# Altium schematic sheet pca63100_top.SchDoc: Power Profiler Kit II
size A3; Organization: Nordic Semiconductor; Revision: 1.0.1; SheetNumber: 1; SheetTotal: 6; CompanyName: Nordic Semiconductor; DocumentSize: A3
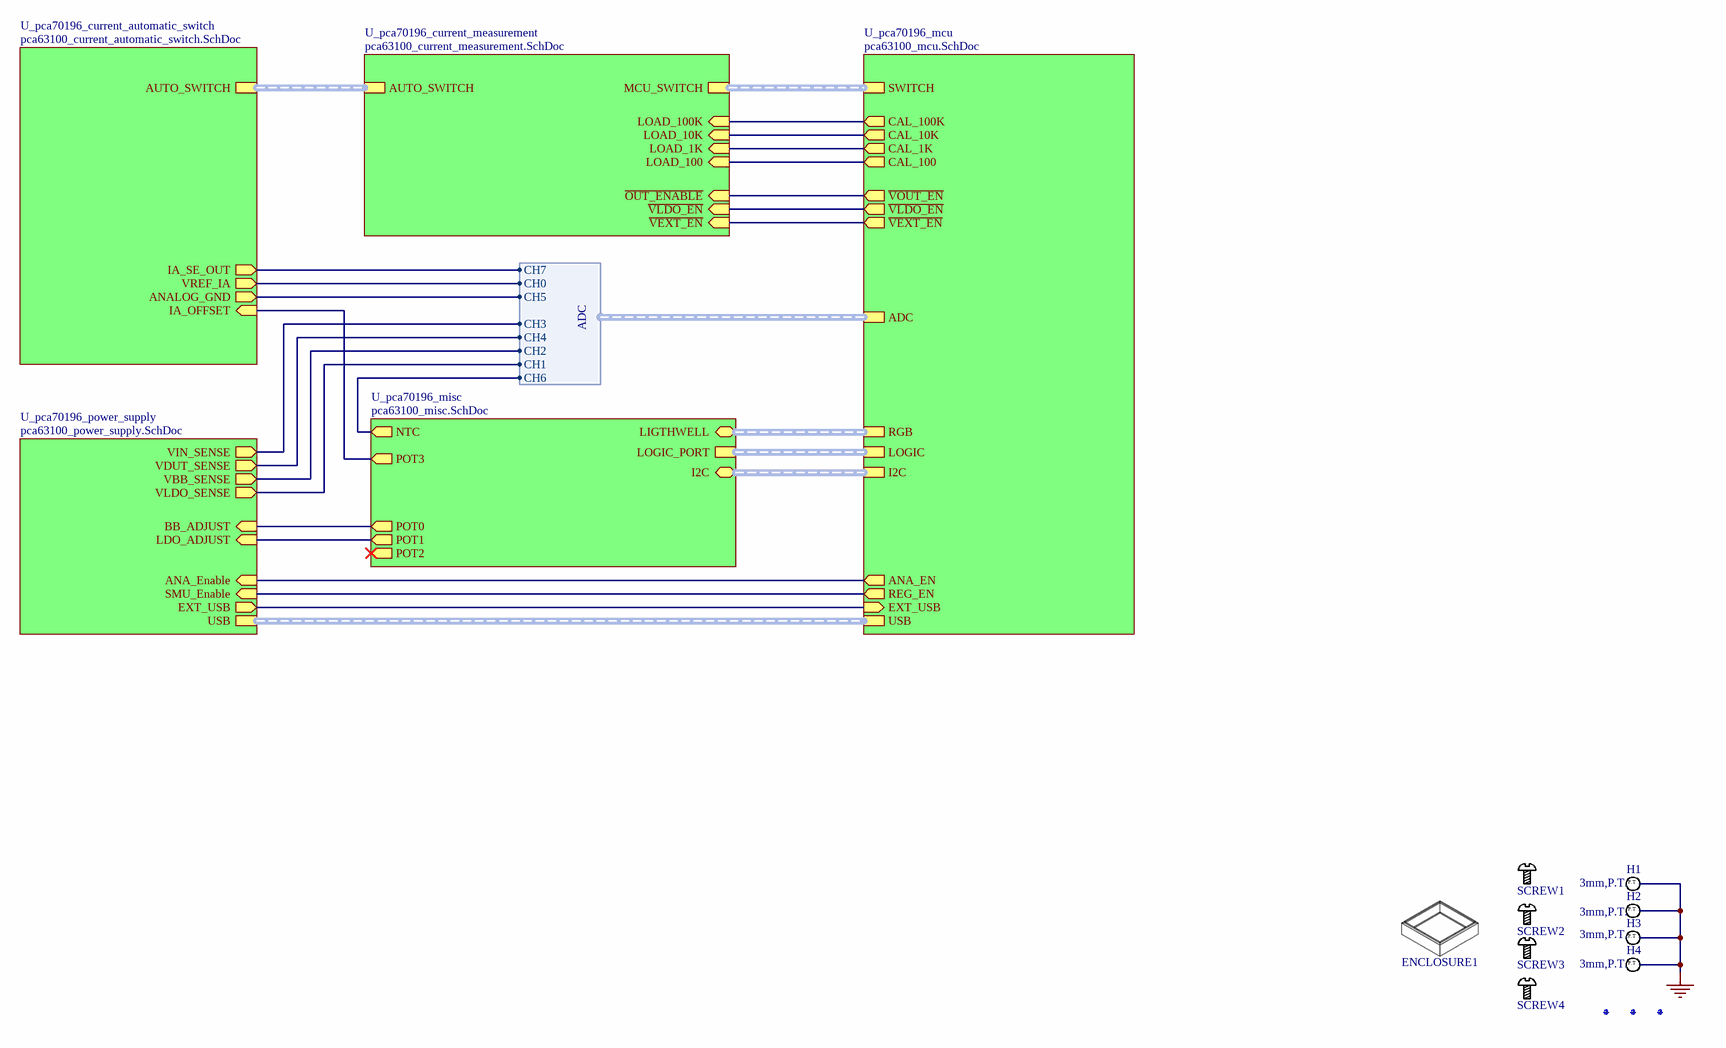
[diagram p0: pca63100_top.SchDoc]

## Parts
ENCLOSURE1  Plastic Enclosure  [Enclosure_PPK2]  (value not drawn)
Fid1  Fiducial mark  [Fiducial_Round-Square]  (value not drawn)  (no BOM)
Fid2  Fiducial mark  [Fiducial_Round-Square]  (value not drawn)  (no BOM)
Fid3  Fiducial mark  [Fiducial_Round-Square]  (value not drawn)  (no BOM)
H1  3mm,P.T.  [HOLE_PT_3MM]  (no BOM)
H2  3mm,P.T.  [HOLE_PT_3MM]  (no BOM)
H3  3mm,P.T.  [HOLE_PT_3MM]  (no BOM)
H4  3mm,P.T.  [HOLE_PT_3MM]  (no BOM)
SCREW1  Screw  [Screw_25x50_pan_tx]  (value not drawn)
SCREW2  Screw  [Screw_25x50_pan_tx]  (value not drawn)
SCREW3  Screw  [Screw_25x50_pan_tx]  (value not drawn)
SCREW4  Screw  [Screw_25x50_pan_tx]  (value not drawn)

## Sub-sheets
U_pca70196_current_automatic_switch = pca63100_current_automatic_switch.SchDoc: IA_SE_OUT (out), IA_OFFSET (in), AUTO_SWITCH (harness SW), VREF_IA (out), ANALOG_GND (out)
U_pca70196_current_measurement = pca63100_current_measurement.SchDoc: ~{OUT_ENABLE} (in), LOAD_100 (in), LOAD_1K (in), LOAD_100K (in), LOAD_10K (in), ~{VEXT_EN} (in), MCU_SWITCH (harness SW), AUTO_SWITCH (harness SW), ~{VLDO_EN} (in)
U_pca70196_mcu = pca63100_mcu.SchDoc: RGB (harness LED), SWITCH (harness SW), I2C (harness I2C), ADC (harness ADC), CAL_10K (out), USB (harness USB), CAL_100K (out), CAL_1K (out), ~{VEXT_EN} (out), CAL_100 (out), ~{VLDO_EN} (out), ~{VOUT_EN} (out), EXT_USB (in), REG_EN (out), ANA_EN (out), LOGIC (harness LP)
U_pca70196_misc = pca63100_misc.SchDoc: POT0 (out), POT1 (out), POT2 (out), POT3 (out), LIGTHWELL (bidir, harness LED), I2C (bidir, harness I2C), NTC (out), LOGIC_PORT (harness LP)
U_pca70196_power_supply = pca63100_power_supply.SchDoc: USB (harness USB), BB_ADJUST (in), LDO_ADJUST (in), VDUT_SENSE (out), VIN_SENSE (out), VLDO_SENSE (out), VBB_SENSE (out), EXT_USB (out), ANA_Enable (in), SMU_Enable (in)

## Harnesses
ADC: CH0, CH1, CH2, CH3, CH4, CH5, CH6, CH7

## Nets
GND: H1.1 H2.1 H3.1 H4.1
(unnamed): sheet U_pca70196_current_automatic_switch/IA_SE_OUT, sheet U_pca70196_mcu/ADC.CH7
(unnamed): sheet U_pca70196_current_automatic_switch/IA_OFFSET, sheet U_pca70196_misc/POT3
(unnamed): sheet U_pca70196_current_automatic_switch/VREF_IA, sheet U_pca70196_mcu/ADC.CH0
(unnamed): sheet U_pca70196_current_automatic_switch/ANALOG_GND, sheet U_pca70196_mcu/ADC.CH5
(unnamed): sheet U_pca70196_current_measurement/~{OUT_ENABLE}, sheet U_pca70196_mcu/~{VOUT_EN}
(unnamed): sheet U_pca70196_current_measurement/LOAD_100, sheet U_pca70196_mcu/CAL_100
(unnamed): sheet U_pca70196_current_measurement/LOAD_1K, sheet U_pca70196_mcu/CAL_1K
(unnamed): sheet U_pca70196_current_measurement/LOAD_100K, sheet U_pca70196_mcu/CAL_100K
(unnamed): sheet U_pca70196_current_measurement/LOAD_10K, sheet U_pca70196_mcu/CAL_10K
(unnamed): sheet U_pca70196_current_measurement/~{VEXT_EN}, sheet U_pca70196_mcu/~{VEXT_EN}
(unnamed): sheet U_pca70196_current_measurement/~{VLDO_EN}, sheet U_pca70196_mcu/~{VLDO_EN}
(unnamed): sheet U_pca70196_power_supply/BB_ADJUST, sheet U_pca70196_misc/POT0
(unnamed): sheet U_pca70196_power_supply/LDO_ADJUST, sheet U_pca70196_misc/POT1
(unnamed): sheet U_pca70196_power_supply/VDUT_SENSE, sheet U_pca70196_mcu/ADC.CH4
(unnamed): sheet U_pca70196_power_supply/VIN_SENSE, sheet U_pca70196_mcu/ADC.CH3
(unnamed): sheet U_pca70196_power_supply/VLDO_SENSE, sheet U_pca70196_mcu/ADC.CH1
(unnamed): sheet U_pca70196_power_supply/VBB_SENSE, sheet U_pca70196_mcu/ADC.CH2
(unnamed): sheet U_pca70196_power_supply/EXT_USB, sheet U_pca70196_mcu/EXT_USB
(unnamed): sheet U_pca70196_power_supply/ANA_Enable, sheet U_pca70196_mcu/ANA_EN
(unnamed): sheet U_pca70196_power_supply/SMU_Enable, sheet U_pca70196_mcu/REG_EN
(unnamed): sheet U_pca70196_misc/NTC, sheet U_pca70196_mcu/ADC.CH6

## Buses and harness runs
harness sheet U_pca70196_current_automatic_switch/AUTO_SWITCH = sheet U_pca70196_current_measurement/AUTO_SWITCH
harness sheet U_pca70196_current_measurement/MCU_SWITCH = sheet U_pca70196_mcu/SWITCH
harness sheet U_pca70196_mcu/I2C = sheet U_pca70196_misc/I2C
harness sheet U_pca70196_mcu/LOGIC = sheet U_pca70196_misc/LOGIC_PORT
harness sheet U_pca70196_mcu/RGB = sheet U_pca70196_misc/LIGTHWELL
harness sheet U_pca70196_mcu/USB = sheet U_pca70196_power_supply/USB

## Notes on the sheet
- Size
- Date:
- A3
- Project Number
- Sheet         of
- Revision
- File:
- Drawn By:
- (in symbol Hole_3MM_PT) P.T

## Library data of the parts
ENCLOSURE1 = Enclosure_PPK2: PPK2 Moulded plastic casing; Manufacturer: Proto Labs, Inc.; Manufacturer Part Number: PPK plexi rev 1.2; Part number IPS: 4971; Pad Count: 0; Part Number: Enclosure_PPK2; ComponentLink1Description: Datasheet; ComponentLink2Description: Supplier link; HelpURL: https://www.protolabs.com; Footprint Doc: Plastic casing; LatestRevisionDate: 2020-10-01; Publisher: Nordic Semiconductor; Published: 2020-10-01; Value: Plastic Enclosure; Component Class: Mechanical; PartId: 101200001
Fid1-Fid3 = Fid-Mark-Round-Square: Artikkelnr Noca: N.A.; Pad Count: 1; Part Number: Fid-Mark-Round-Square; LatestRevisionDate: 2017-01-30; Pin Count: 1; Publisher: Nordic Semiconductor; Published: 2009-12-12; Footprint Doc: Fiducial; Part number IPS: N.A.; ComponentLink1Description: Datasheet; ComponentLink2Description: Supplier link; Component Class: Connectors; PartId: 100500075
H1-H4 = Hole_3MM_PT: Regular Plate Through, 3mm hole; Manufacturer: Nordic Semiconductor; Artikkelnr Noca: N.A.; Pad Count: 1; Part Number: Hole_3MM_PT; Footprint Doc: Hole_3MM_PT; LatestRevisionDate: 2013-05-29; Pin Count: 1; Publisher: Nordic Semiconductor; Published: 2013-05-29; Value: 3mm,P.T.; Note: Regular Plate Through, 3mm hole; Part number IPS: N.A.; ComponentLink1Description: Datasheet; ComponentLink2Description: Supplier link; Component Class: Connectors; PartId: 100500146
SCREW1-SCREW4 = Screw_25x50_pan_tx: Pan head, torx, 2.5x5mm screw; Manufacturer: Bossard; Manufacturer Part Number: 3205129; Part number IPS: 4972; Pad Count: 0; Part Number: Screw_25x50_pan_tx; ComponentLink1Description: Datasheet; ComponentLink2Description: Supplier link; HelpURL: https://www.tme.eu/pl/en/details/b2.5x5_bn13265/screws/bossard/3205129/; Footprint Doc: T8 screw; LatestRevisionDate: 2020-10-01; Publisher: Nordic Semiconductor; Published: 2020-10-01; Value: Screw; Component Class: Mechanical; PartId: 101200002